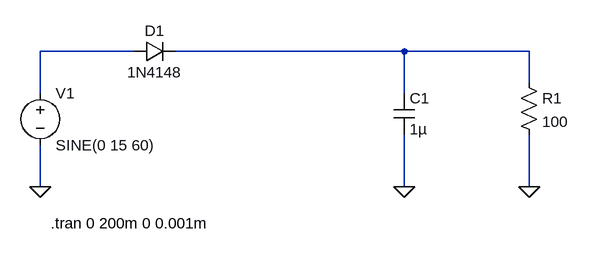
[diagram p0: schematic rectificador_monofásico_meia-onda_RC.asc]
rectificador_monofásico_meia-onda_RC.asc, the LTspice schematic file:
Version 4
SHEET 1 880 680
WIRE 192 80 48 80
WIRE 608 80 256 80
WIRE 800 80 608 80
WIRE 800 128 800 80
WIRE 48 144 48 80
WIRE 608 144 608 80
WIRE 48 288 48 224
WIRE 608 288 608 208
WIRE 800 288 800 208
FLAG 48 288 0
FLAG 800 288 0
FLAG 608 288 0
SYMBOL voltage 48 128 R0
WINDOW 123 0 0 Left 0
WINDOW 39 0 0 Left 0
SYMATTR InstName V1
SYMATTR Value SINE(0 15 60)
SYMBOL diode 192 96 R270
WINDOW 0 32 32 VTop 2
WINDOW 3 0 32 VBottom 2
SYMATTR InstName D1
SYMATTR Value 1N4148
SYMBOL res 784 112 R0
SYMATTR InstName R1
SYMATTR Value 100
SYMBOL cap 592 144 R0
SYMATTR InstName C1
SYMATTR Value 1µ
TEXT 64 344 Left 2 !.tran 0 200m 0 0.001m

The netlist it stands for:
* rectificador_monofásico_meia-onda_RC.asc
V1 N001 0 SINE(0 15 60)
D1 N001 N002 1N4148
R1 N002 0 100
C1 N002 0 1µ
.model D D
.lib standard.dio
.tran 0 200m 0 0.001m
.backanno
.end